# Altium schematic sheet control-boardv1.0.SchDoc
size A3
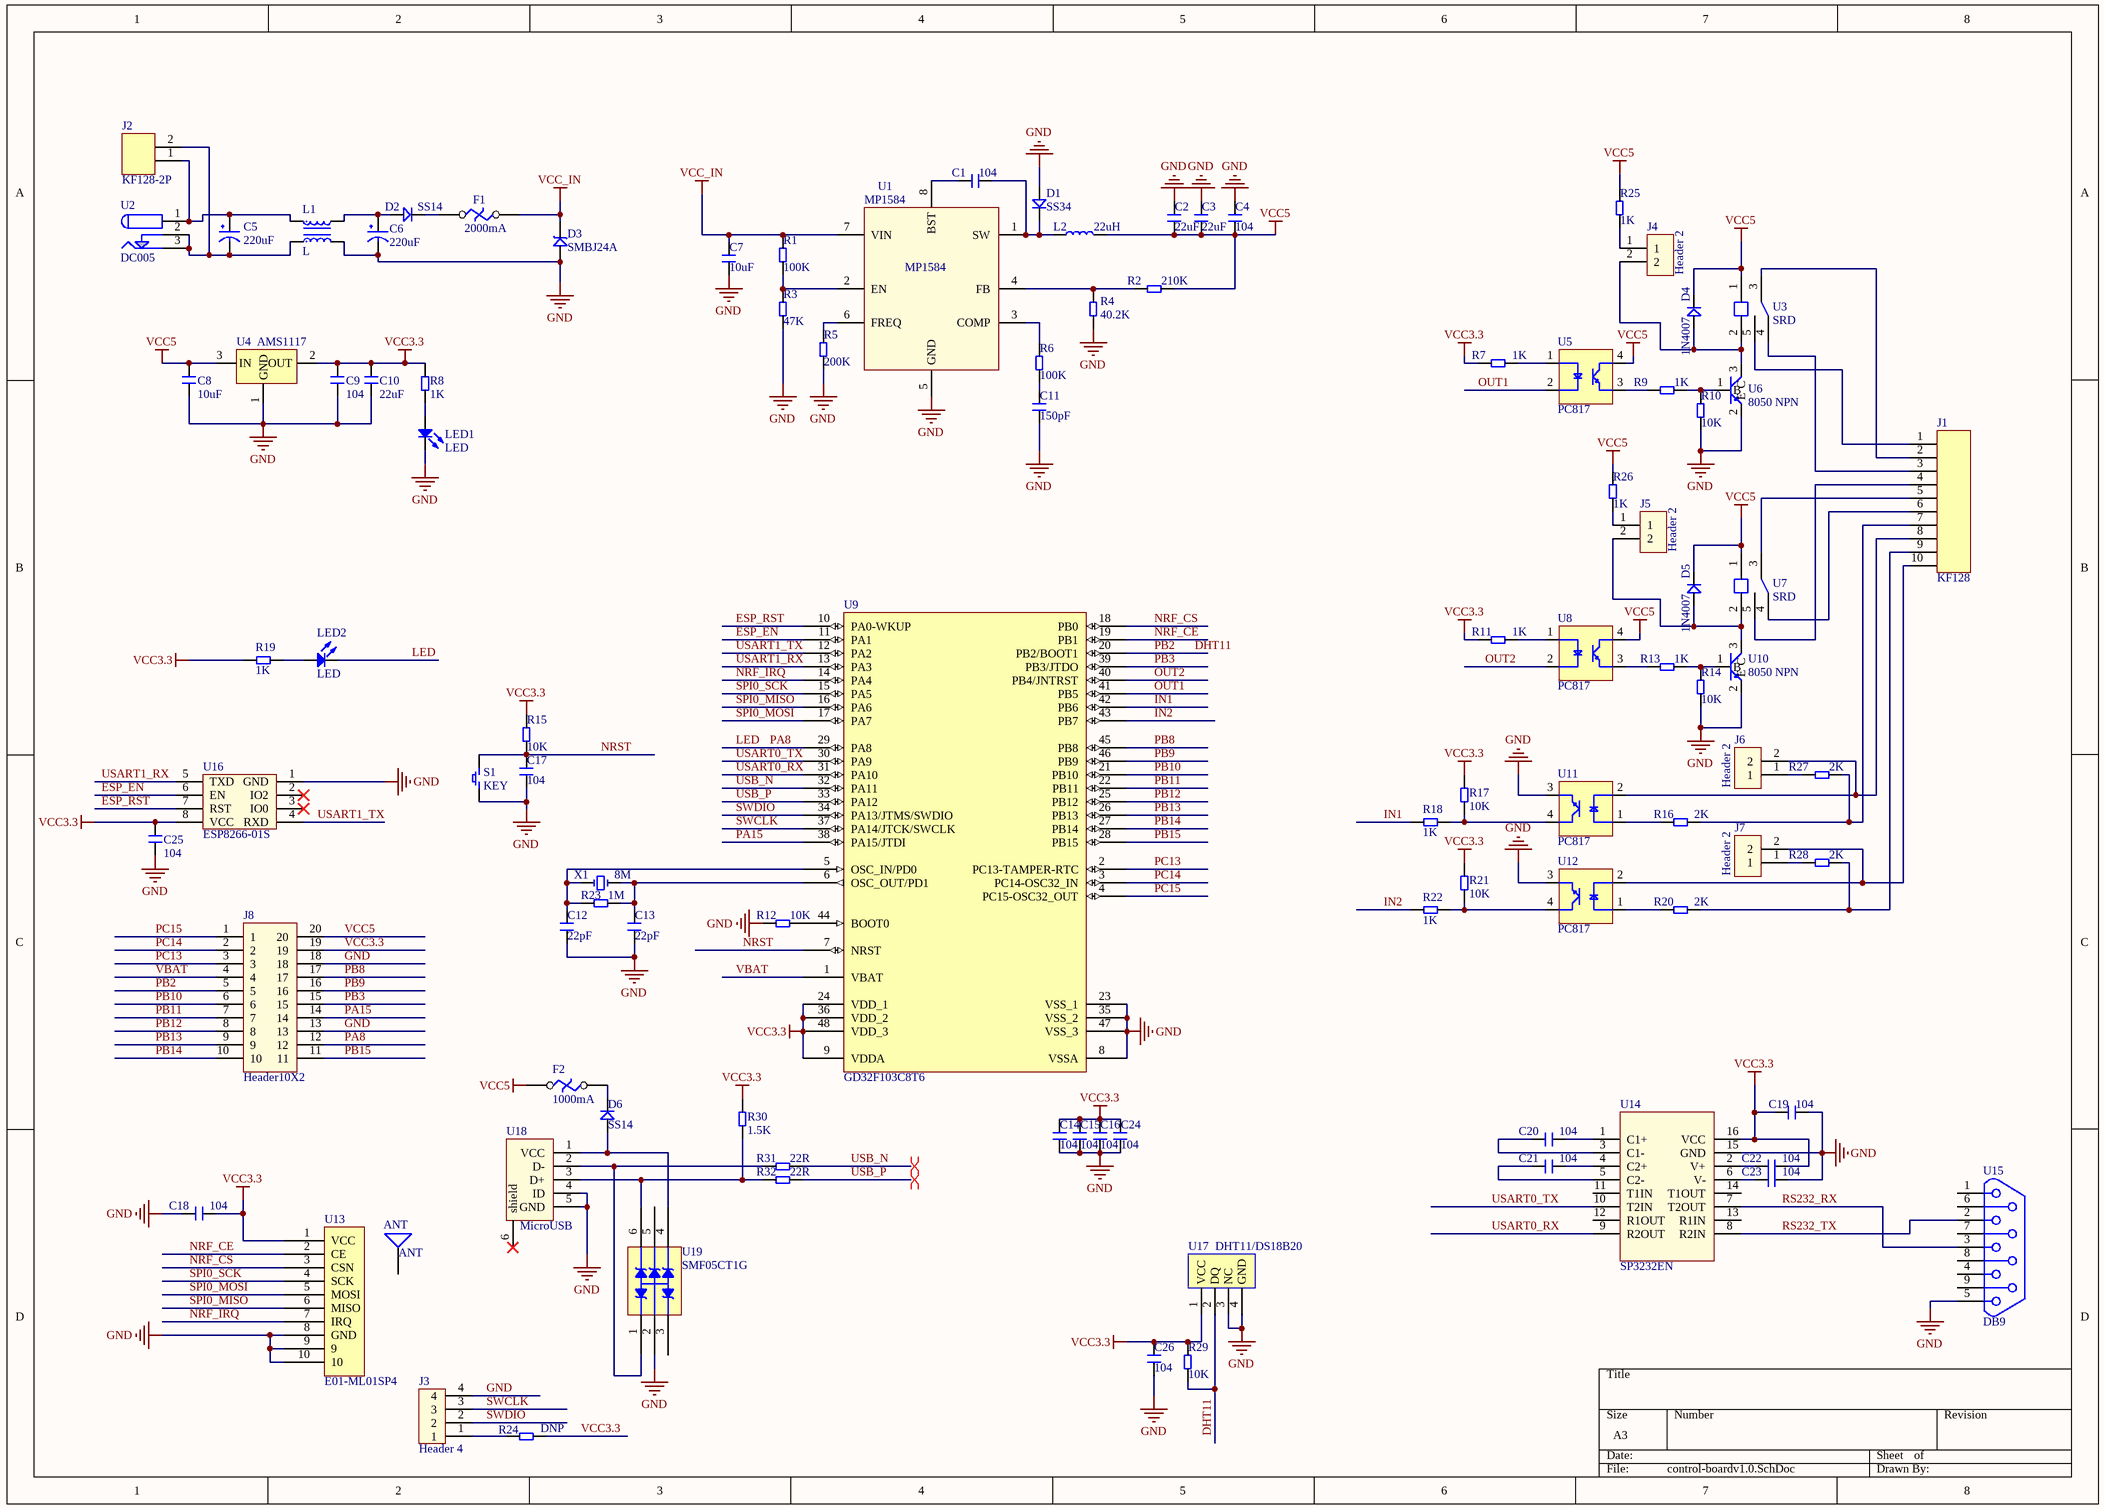
[diagram p0: control-boardv1.0.SchDoc]

## Parts
ANT  ANT  [ANT-SMA-FR]
C1  104  [C 0603]
C2  22uF  [C 0805]
C3  22uF  [C 0805]
C4  104  [C 0603]
C5  220uF  [CS 3.5*8*11.5 - C]
C6  220uF  [CS 3.5*8*11.5 - C]
C7  10uF  [C 0805]
C8  10uF  [C 0805]
C9  104  [C 0603]
C10  22uF  [C 0805]
C11  150pF  [C 0603]
C12  22pF  [C 0603]
C13  22pF  [C 0603]
C14  104  [C 0603]
C15  104  [C 0603]
C16  104  [C 0603]
C17  104  [C 0603]
C18  104  [C 0603]
C19  104  [C 0603]
C20  104  [C 0603]
C21  104  [C 0603]
C22  104  [C 0603]
C23  104  [C 0603]
C24  104  [C 0603]
C25  104  [C 0603]
C26  104  [C 0603]
D1  SS34  [SMA]
D2  SS14  [SMA]
D3  SMBJ24A  [SMA]
D4  1N4007  [LL34]
D5  1N4007  [LL34]
D6  SS14  [SMA]
F1  2000mA  [F 1206]
F2  1000mA  [F 1206]
J1  KF128  [KF128-5.08-10P]
J2  KF128-2P  [KF128-5.08-2P]
J3  Header 4  [XH2.54-LI-4P]
J4  Header 2  [XH2.54-LI-2P]
J5  Header 2  [XH2.54-LI-2P]
J6  Header 2  [XH2.54-LI-2P]
J7  Header 2  [XH2.54-LI-2P]
J8  Header10X2  [HDR2.54-LI-2x10P]
L1  L  [L UU9.8]
L2  22uH  [L CDRH74]
LED1  LED  [LED 3MM]
LED2  LED  [LED 3MM]
R1  100K  [R 0603]
R2  210K  [R 0603]
R3  47K  [R 0603]
R4  40.2K  [R 0603]
R5  200K  [R 0603]
R6  100K  [R 0603]
R7  1K  [R 0603]
R8  1K  [R 0603]
R9  1K  [R 0603]
R10  10K  [R 0603]
R11  1K  [R 0603]
R12  10K  [R 0603]
R13  1K  [R 0603]
R14  10K  [R 0603]
R15  10K  [R 0603]
R16  2K  [R 0603]
R17  10K  [R 0603]
R18  1K  [R 0603]
R19  1K  [R 0603]
R20  2K  [R 0603]
R21  10K  [R 0603]
R22  1K  [R 0603]
R23  1M  [R 0603]
R24  DNP  [R 0603]
R25  1K  [R 0603]
R26  1K  [R 0603]
R27  2K  [R 0603]
R28  2K  [R 0603]
R29  10K  [R 0603]
R30  1.5K  [R 0603]
R31  22R  [R 0603]
R32  22R  [R 0603]
S1  KEY  [KEY SMD-3*6*2.5]
U1  MP1584  [MP1584 SOP8]
U2  DC005  [DC005]
U3  SRD  [SRD-C]
U4  AMS1117  [SOT223]
U5  PC817  [DIP4]
U6  8050 NPN  [SOT23-3]
U7  SRD  [SRD-C]
U8  PC817  [DIP4]
U9  GD32F103C8T6  [LQFP48]
U10  8050 NPN  [SOT23-3]
U11  PC817  [DIP4]
U12  PC817  [DIP4]
U13  E01-ML01SP4  [E01-ML01SP4]
U14  SP3232EN  [TSSOP16]
U15  DB9  [DB9-MALE]
U16  ESP8266-01S  [ESP8266-01S]
U17  DHT11/DS18B20  [DHT11]
U18  MicroUSB  [USB MICROUSB-L]
U19  SMF05CT1G  [LC-SC-70-6(SOT-363)]
X1  8M  [XTAL-HC49S]

## Nets
GND: C2.2 C3.2 C4.2 C6.2(-) C7.1 C8.1 C9.1 C10.1 C11.1 C12.1 C13.1 C14.1 C15.1 C16.1 C17.1 C18.2 C19.1 C23.2 C24.1 C25.2 C26.2 D1.1 D3.1 J3.4 J8.13 J8.18 L1.3 LED1.2(K) R3.1 R4.1 R5.1 R10.1 R12.1 R14.1 S1.1 U1.5(GND) U4.1(GND) U6.2(E) U9.8(VSSA) U9.23(VSS_1) U9.35(VSS_2) U9.47(VSS_3) U10.2(E) U11.3 U12.3 U13.8(GND) U13.9 U13.10 U14.15(GND) U15.5 U16.1(GND) U17.3(NC) U17.4(GND) U18.4(ID) U18.5(GND) U19.2
VCC3.3: C9.2 C10.2 C14.2 C15.2 C16.2 C18.1 C19.2 C22.2 C24.2 C25.1 C26.1 J8.19 R7.1 R8.2 R11.1 R15.2 R17.2 R19.2 R21.2 R24.2 R29.2 R30.2 U4.2(OUT) U9.9(VDDA) U9.24(VDD_1) U9.36(VDD_2) U9.48(VDD_3) U13.1(VCC) U14.16(VCC) U16.8(VCC) U17.1(VCC)
VCC5: C2.1 C3.1 C4.1 C8.2 D4.2 D5.2 F2.2 J8.20 L2.1 R2.2 R25.2 R26.2 U3.1 U4.3(IN) U5.4 U7.1 U8.4
VCC_IN: C7.2 D3.2 F1.2 R1.2 U1.7(VIN)
DHT11: J8.5 R29.1 U9.20(PB2/BOOT1) U17.2(DQ)  [also labelled PB2]
ESP_EN: U9.11(PA1) U16.6(EN)
ESP_RST: U9.10(PA0-WKUP) U16.7(RST)
IN1: R18.1 U9.42(PB6)
IN2: R22.1 U9.43(PB7)
LED: J8.12 LED2.2(K) U9.29(PA8)  [also labelled PA8]
NRF_CE: U9.19(PB1) U13.2(CE)
NRF_CS: U9.18(PB0) U13.3(CSN)
NRF_IRQ: U9.14(PA4) U13.7(IRQ)
NRST: C17.2 R15.1 S1.2 U9.7(NRST)
OUT1: U5.2 U9.41(PB5)
OUT2: U8.2 U9.40(PB4/JNTRST)
PA15: J8.14 U9.38(PA15/JTDI)
PB3: J8.15 U9.39(PB3/JTDO)
PB8: J8.17 U9.45(PB8)
PB9: J8.16 U9.46(PB9)
PB10: J8.6 U9.21(PB10)
PB11: J8.7 U9.22(PB11)
PB12: J8.8 U9.25(PB12)
PB13: J8.9 U9.26(PB13)
PB14: J8.10 U9.27(PB14)
PB15: J8.11 U9.28(PB15)
PC13: J8.3 U9.2(PC13-TAMPER-RTC)
PC14: J8.2 U9.3(PC14-OSC32_IN)
PC15: J8.1 U9.4(PC15-OSC32_OUT)
RS232_RX: U14.7(T2OUT) U15.3
RS232_TX: U14.8(R2IN) U15.2
SPI0_MISO: U9.16(PA6) U13.6(MISO)
SPI0_MOSI: U9.17(PA7) U13.5(MOSI)
SPI0_SCK: U9.15(PA5) U13.4(SCK)
SWCLK: J3.3 U9.37(PA14/JTCK/SWCLK)
SWDIO: J3.2 U9.34(PA13/JTMS/SWDIO)
USART0_RX: U9.31(PA10) U14.9(R2OUT)
USART0_TX: U9.30(PA9) U14.10(T2IN)
USART1_RX: U9.13(PA3) U16.5(TXD)
USART1_TX: U9.12(PA2) U16.4(RXD)
USB_N: R31.2 U9.32(PA11)
USB_P: R32.2 U9.33(PA12)
VBAT: J8.4 U9.1(VBAT)
NetC1_1: C1.1 D1.2 L2.2 U1.1(SW)
NetC1_2: C1.2 U1.8(BST)
NetC5_1: C5.1(+) J2.1 L1.1 U2.1
NetC5_2: C5.2(-) J2.2 L1.4 U2.2 U2.3
NetC6_1: C6.1(+) D2.1 L1.2
NetC11_2: C11.2 R6.1
NetC12_2: C12.2 R23.2 U9.5(OSC_IN/PD0) X1.1
NetC13_2: C13.2 R23.1 U9.6(OSC_OUT/PD1) X1.2
NetC20_1: C20.1 U14.3(C1-)
NetC20_2: C20.2 U14.1(C1+)
NetC21_1: C21.1 U14.5(C2-)
NetC21_2: C21.2 U14.4(C2+)
NetC22_1: C22.1 U14.2(V+)
NetC23_1: C23.1 U14.6(V-)
NetD2_2: D2.2 F1.1
NetD4_1: D4.1 J4.2 U3.2 U6.3(C)
NetD5_1: D5.1 J5.2 U7.2 U10.3(C)
NetD6_1: D6.1 U18.1(VCC) U19.4
NetD6_2: D6.2 F2.1
NetJ1_1: J1.1 U3.5
NetJ1_2: J1.2 U3.3
NetJ1_3: J1.3 U3.4
NetJ1_4: J1.4 U7.5
NetJ1_5: J1.5 U7.3
NetJ1_6: J1.6 U7.4
NetJ1_7: J1.7 R16.2 R27.2
NetJ1_8: J1.8 J6.2 U11.2
NetJ1_9: J1.9 R20.2 R28.2
NetJ1_10: J1.10 J7.2 U12.2
NetJ3_1: J3.1 R24.1
NetJ4_1: J4.1 R25.1
NetJ5_1: J5.1 R26.1
NetJ6_1: J6.1 R27.1
NetJ7_1: J7.1 R28.1
NetLED1_1: LED1.1(A) R8.1
NetLED2_1: LED2.1(A) R19.1
NetR1_1: R1.1 R3.2 U1.2(EN)
NetR2_1: R2.1 R4.2 U1.4(FB)
NetR5_2: R5.2 U1.6(FREQ)
NetR6_2: R6.2 U1.3(COMP)
NetR7_2: R7.2 U5.1
NetR9_1: R9.1 U5.3
NetR9_2: R9.2 R10.2 U6.1(B)
NetR11_2: R11.2 U8.1
NetR12_2: R12.2 U9.44(BOOT0)
NetR13_1: R13.1 U8.3
NetR13_2: R13.2 R14.2 U10.1(B)
NetR16_1: R16.1 U11.1
NetR17_1: R17.1 R18.2 U11.4
NetR20_1: R20.1 U12.1
NetR21_1: R21.1 R22.2 U12.4
NetR30_1: R30.1 R32.1 U18.3(D+) U19.6
NetR31_1: R31.1 U18.2(D-) U19.1

Not connected (* = marked no-connect by the designer): ANT 1; U14 11(T1IN) 12(R1OUT) 13(R1IN) 14(T1OUT); U15 1 4 6 7 8 9; U16 2(IO2)* 3(IO0)*; U18 6(shield)*; U19 3 5

## Layout directives
differential pair: USB_N, USB_P

## Library data of the parts
C1-C4 C7-C26 = CAP
C5 C6 = CAP Pol: 极性电容
D1 D2 D4-D6 = Diode
D3 = D Schottky
F1 F2 = F: 熔断开关
J1 = KF128-10P
L1 = L2
L2 = L
R1-R32 = RES
U1 = MP1584: DCDC芯片
U3 U7 = SRD: 继电器
U4 = AMS1117: LDO
U5 U8 U11 U12 = PC817: 光耦
U6 U10 = NPN
U13 = 24L01: 2.4G无限模块
U16 = ESP8266-01S: WIFI模块
U17 = DHT11
U19 = SMF05CT1G: TVS; ComponentLink1Description: 供应商链接; ComponentLink1URL: http://www.szlcsc.com/product/details_16561.html; Package: SC-70-6(SOT-363); Supplier: LC; SuppliersPartNumber: C15879
X1 = XTAL-2P